# EasyEDA schematic SCH_Gantry-Sensor-PCB-SMD-6x-1.9_2024-09-11.json
TITLE: Sheet_1; REV: 1.9; Date: 2022-06-12; Sheet: 1/1; Drawn By: Edward Niedziejko; Company: Your Company
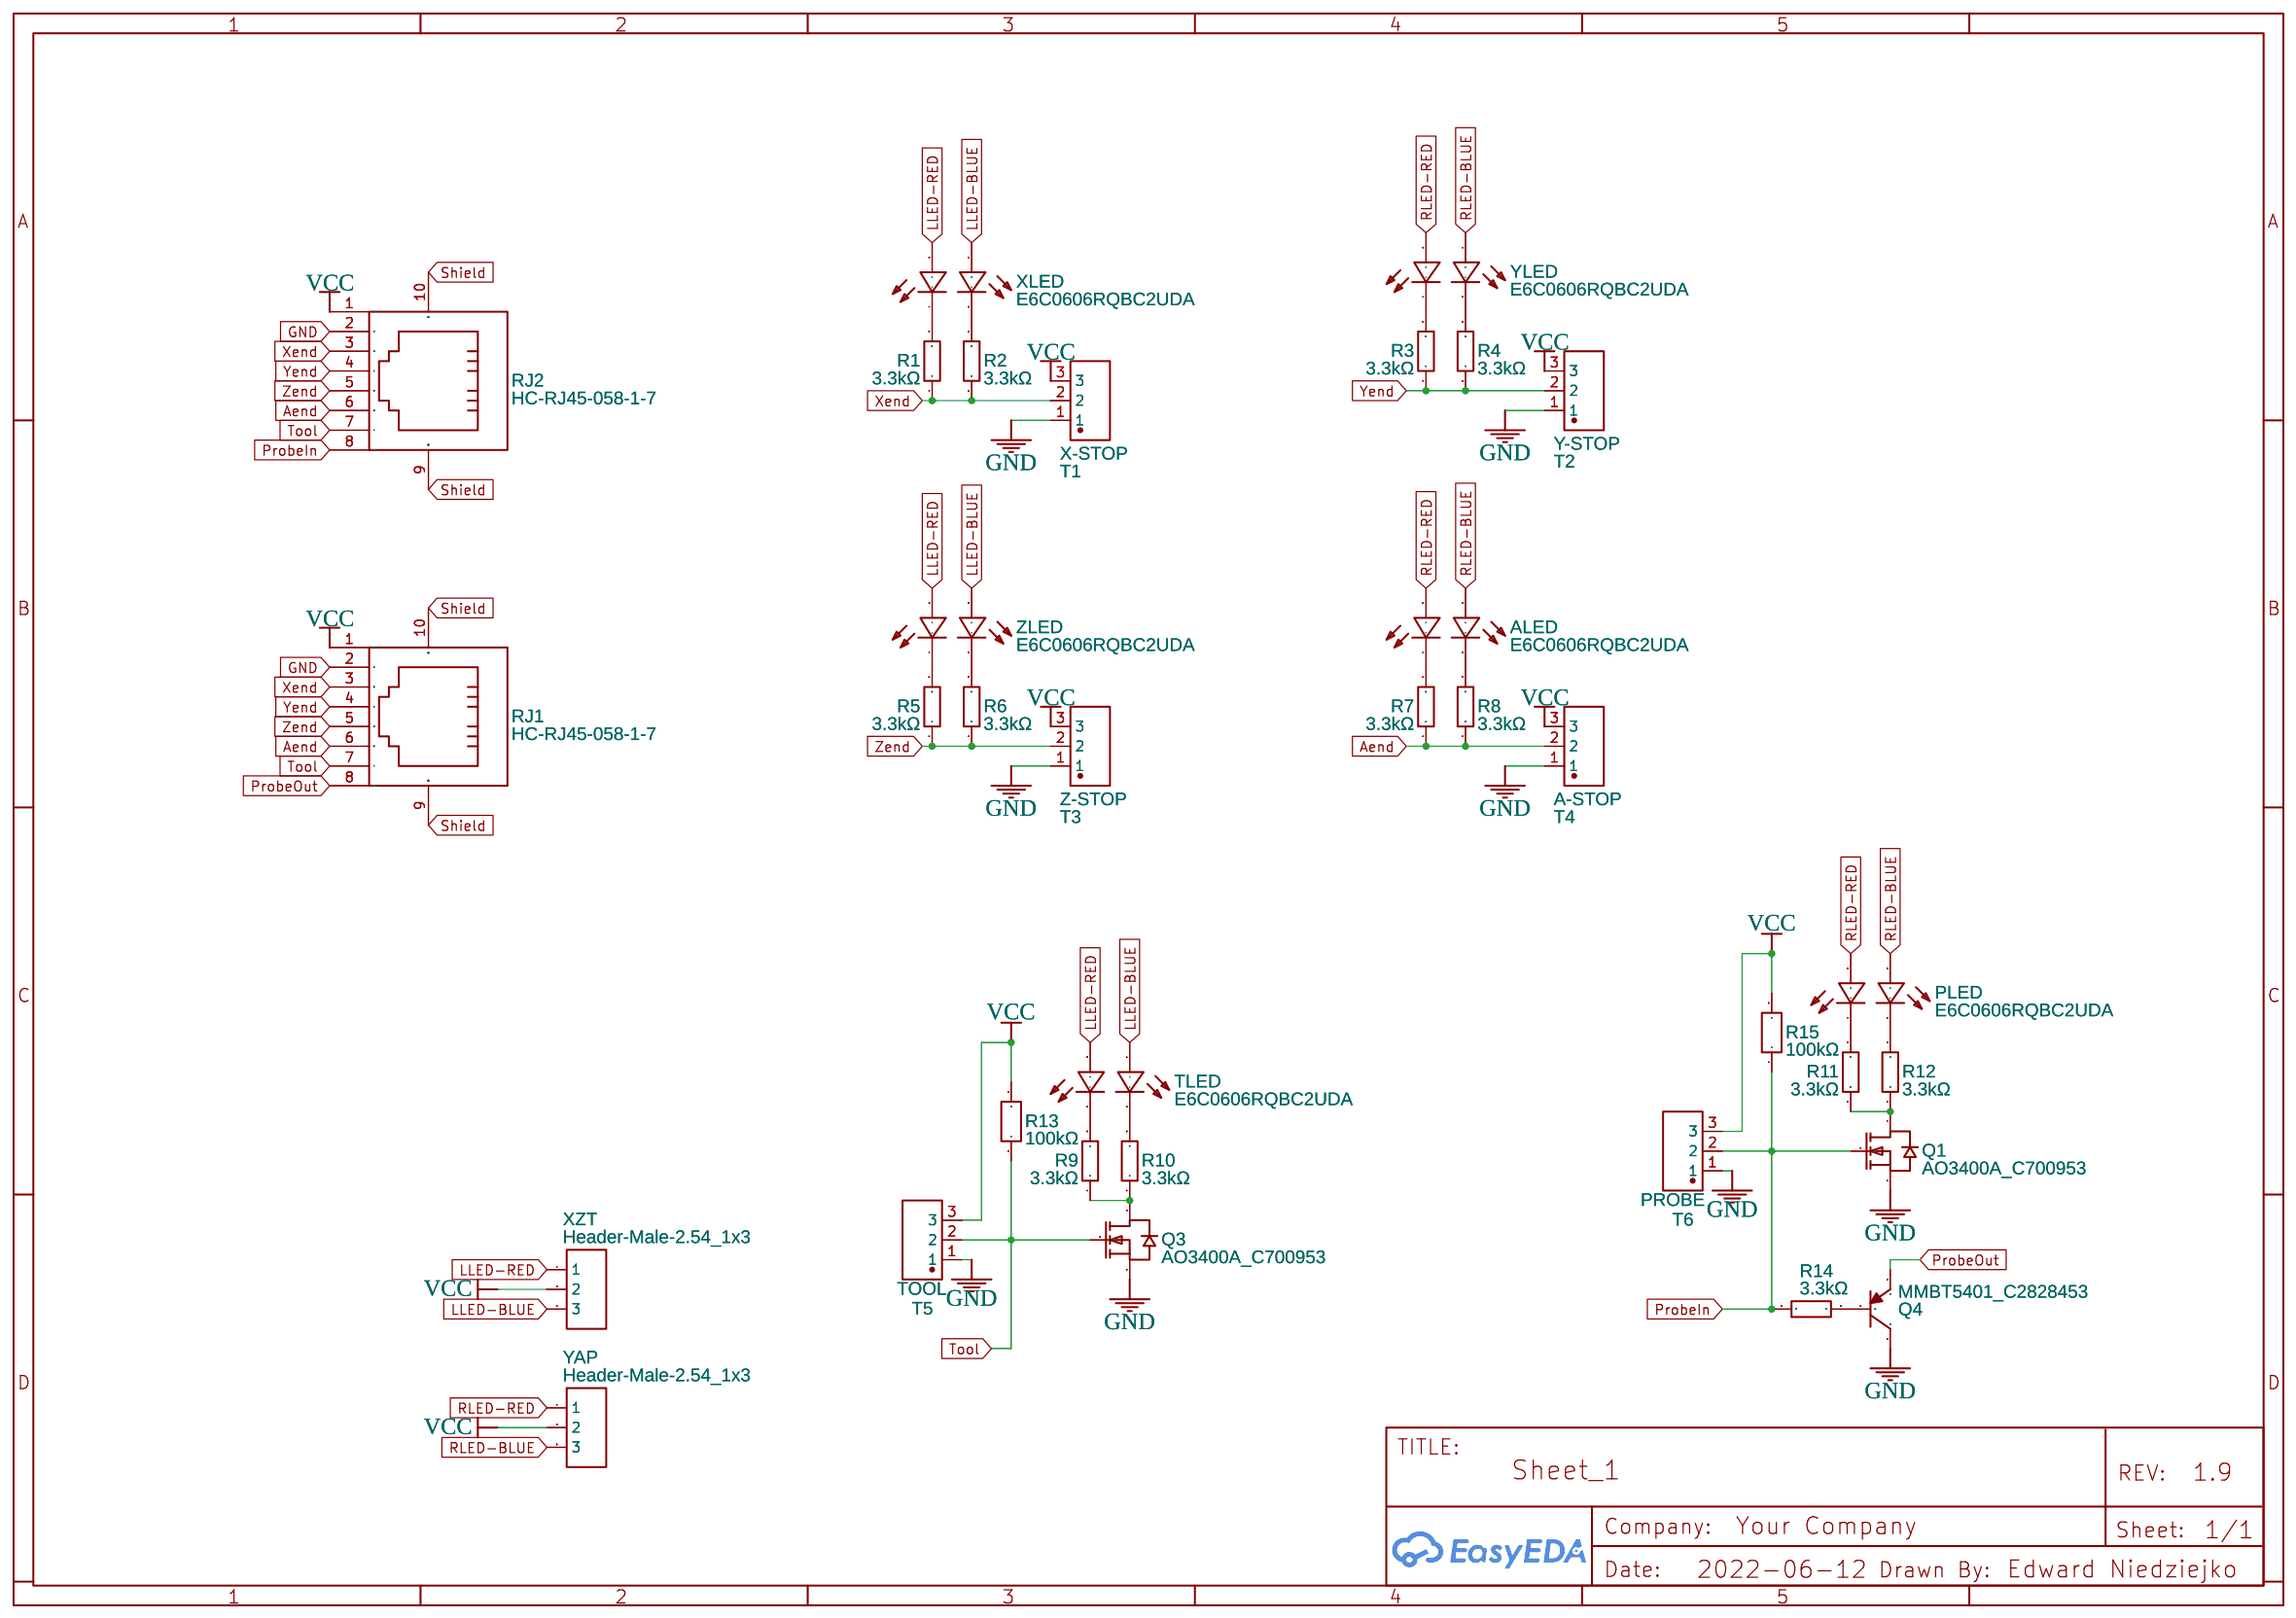
[diagram p0: schematic sheet]

## Parts
ALED  E6C0606RQBC2UDA  [LED-ARRAY-SMD_4P-L1.6-W1.6-P0.90-BR-RD]
PLED  E6C0606RQBC2UDA  [LED-ARRAY-SMD_4P-L1.6-W1.6-P0.90-BR-RD]
Q1  AO3400A_C700953  [SOT-23-3_L2.9-W1.3-P1.90-LS2.4-BR]
Q3  AO3400A_C700953  [SOT-23-3_L2.9-W1.3-P1.90-LS2.4-BR]
Q4  MMBT5401_C2828453  [SOT-23-3_L2.9-W1.4-P1.90-LS2.4-TR]
R1  3.3kΩ  [R0402]
R2  3.3kΩ  [R0402]
R3  3.3kΩ  [R0402]
R4  3.3kΩ  [R0402]
R5  3.3kΩ  [R0402]
R6  3.3kΩ  [R0402]
R7  3.3kΩ  [R0402]
R8  3.3kΩ  [R0402]
R9  3.3kΩ  [R0402]
R10  3.3kΩ  [R0402]
R11  3.3kΩ  [R0402]
R12  3.3kΩ  [R0402]
R13  100kΩ  [R0402]
R14  3.3kΩ  [R0402]
R15  100kΩ  [R0402]
RJ1  HC-RJ45-058-1-7  [RJ45-TH_HC-RJ45-058-1-7]
RJ2  HC-RJ45-058-1-7  [RJ45-TH_HC-RJ45-058-1-7]
T1  X-STOP  [CONN-TH_3P-P3.50_KF2EDGV-3.5-3P]
T2  Y-STOP  [CONN-TH_3P-P3.50_KF2EDGV-3.5-3P]
T3  Z-STOP  [CONN-TH_3P-P3.50_KF2EDGV-3.5-3P]
T4  A-STOP  [CONN-TH_3P-P3.50_KF2EDGV-3.5-3P]
T5  TOOL  [CONN-TH_3P-P3.50_KF2EDGV-3.5-3P]
T6  PROBE  [CONN-TH_3P-P3.50_KF2EDGV-3.5-3P]
TLED  E6C0606RQBC2UDA  [LED-ARRAY-SMD_4P-L1.6-W1.6-P0.90-BR-RD]
XLED  E6C0606RQBC2UDA  [LED-ARRAY-SMD_4P-L1.6-W1.6-P0.90-BR-RD]
XZT  Header-Male-2.54_1x3  [HDR-TH_3P-P2.54-V-M-1]
YAP  Header-Male-2.54_1x3  [HDR-TH_3P-P2.54-V-M-1]
YLED  E6C0606RQBC2UDA  [LED-ARRAY-SMD_4P-L1.6-W1.6-P0.90-BR-RD]
ZLED  E6C0606RQBC2UDA  [LED-ARRAY-SMD_4P-L1.6-W1.6-P0.90-BR-RD]

## Library data of the parts
ALED PLED TLED XLED YLED ZLED = E6C0606RQBC2UDA: Contributor: LCSC; Supplier: LCSC; Supplier Part: C375544; Manufacturer: ekinglux(亿晶源); JLCPCB Part Class: Extended Part
Q1 Q3 = AO3400A_C700953: Contributor: LCSC; Supplier: LCSC; Supplier Part: C700953; Manufacturer: HUASHUO(华朔); Manufacturer Part: AO3400A; JLCPCB Part Class: Extended Part
Q4 = MMBT5401_C2828453: Contributor: LCSC; Supplier: LCSC; Supplier Part: C2828453; Manufacturer: CBI(创基); Manufacturer Part: MMBT5401 2L; JLCPCB Part Class: Extended Part
R1-R12 R14 = CR0402FF3301G: Supplier: LCSC; Manufacturer: LIZ(丽智电子); Supplier Part: C100376; JLCPCB Part Class: Extended Part
R13 R15 = SCR0402F100K: Contributor: lcsc; Supplier: LCSC; Supplier Part: C3015887; Manufacturer: VO(翔胜); JLCPCB Part Class: Extended Part
RJ1 RJ2 = HC-RJ45-058-1-7: Supplier: LCSC; Supplier Part: C5777774; Manufacturer: HCTL(华灿天禄); Contributor: lcsc; JLCPCB Part Class: Extended Part
T1-T6 = KF2EDGV-3.5-3P: Supplier: LCSC; Supplier Part: C441322; Manufacturer: Cixi Kefa Elec; Contributor: LCSC; JLCPCB Part Class: Extended Part
XZT YAP = Header-Male-2.54_1x3: Supplier: LCSC; Manufacturer: BOOMELE(博穆精密); Manufacturer Part: 2.54-1*3P针; Supplier Part: C49257; JLCPCB Part Class: Extended Part

## Nets
GND: Q1.2(S) Q3.2(S) Q4.3(C) RJ1.2 RJ2.2 T1.1 T2.1 T3.1 T4.1 T5.1 T6.1
VCC: R13.2 R15.2 RJ1.1 RJ2.1 T1.3 T2.3 T3.3 T4.3 T5.3 T6.3 XZT.2 YAP.2
Aend: R7.1 R8.1 RJ1.6 RJ2.6 T4.2
LLED-BLUE: TLED.1(+) XLED.1(+) XZT.3 ZLED.1(+)
LLED-RED: TLED.3(+) XLED.3(+) XZT.1 ZLED.3(+)
ProbeIn: Q1.1(G) R14.2 R15.1 RJ2.8 T6.2
ProbeOut: Q4.1(E) RJ1.8
RLED-BLUE: ALED.1(+) PLED.1(+) YAP.3 YLED.1(+)
RLED-RED: ALED.3(+) PLED.3(+) YAP.1 YLED.3(+)
Shield: RJ1.9(SHELL) RJ1.10(SHELL) RJ2.9(SHELL) RJ2.10(SHELL)
Tool: Q3.1(G) R13.1 RJ1.7 RJ2.7 T5.2
Xend: R1.1 R2.1 RJ1.3 RJ2.3 T1.2
Yend: R3.1 R4.1 RJ1.4 RJ2.4 T2.2
Zend: R5.1 R6.1 RJ1.5 RJ2.5 T3.2
Net-(ALED-2): ALED.2(-) R8.2
Net-(ALED-4): ALED.4(-) R7.2
Net-(PLED-2): PLED.2(-) R12.2
Net-(PLED-4): PLED.4(-) R11.2
Net-(Q1-3): Q1.3(D) R11.1 R12.1
Net-(Q3-3): Q3.3(D) R9.1 R10.1
Net-(Q4-2): Q4.2(B) R14.1
Net-(R1-2): R1.2 XLED.4(-)
Net-(R2-2): R2.2 XLED.2(-)
Net-(R3-2): R3.2 YLED.4(-)
Net-(R4-2): R4.2 YLED.2(-)
Net-(R5-2): R5.2 ZLED.4(-)
Net-(R6-2): R6.2 ZLED.2(-)
Net-(R9-2): R9.2 TLED.4(-)
Net-(R10-2): R10.2 TLED.2(-)
